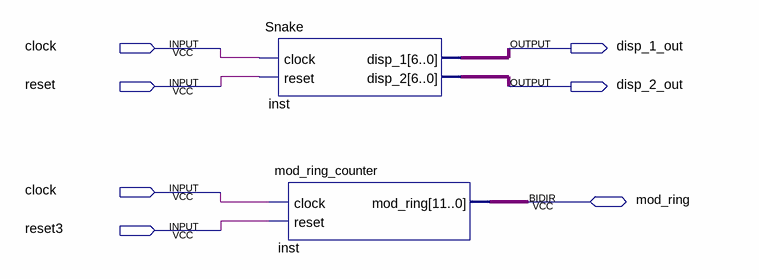
[diagram p0: schematic sheet]
// Quartus schematic Block3.bdf as structural Verilog: 2 symbols, 7 pins
module Block3 (
  input  clock,
  input  reset,
  input  reset3,
  inout  mod_ring,
  output disp_1_out,
  output disp_2_out
);

  wire [6:0] inst_disp_1, inst_disp_2;
  wire [11:0] inst_mod_ring;

  Snake inst (.clock(clock), .reset(reset), .disp_1(inst_disp_1), .disp_2(inst_disp_2));
  mod_ring_counter inst_dup2 (.clock(clock), .reset(reset3), .mod_ring(inst_mod_ring));
endmodule
